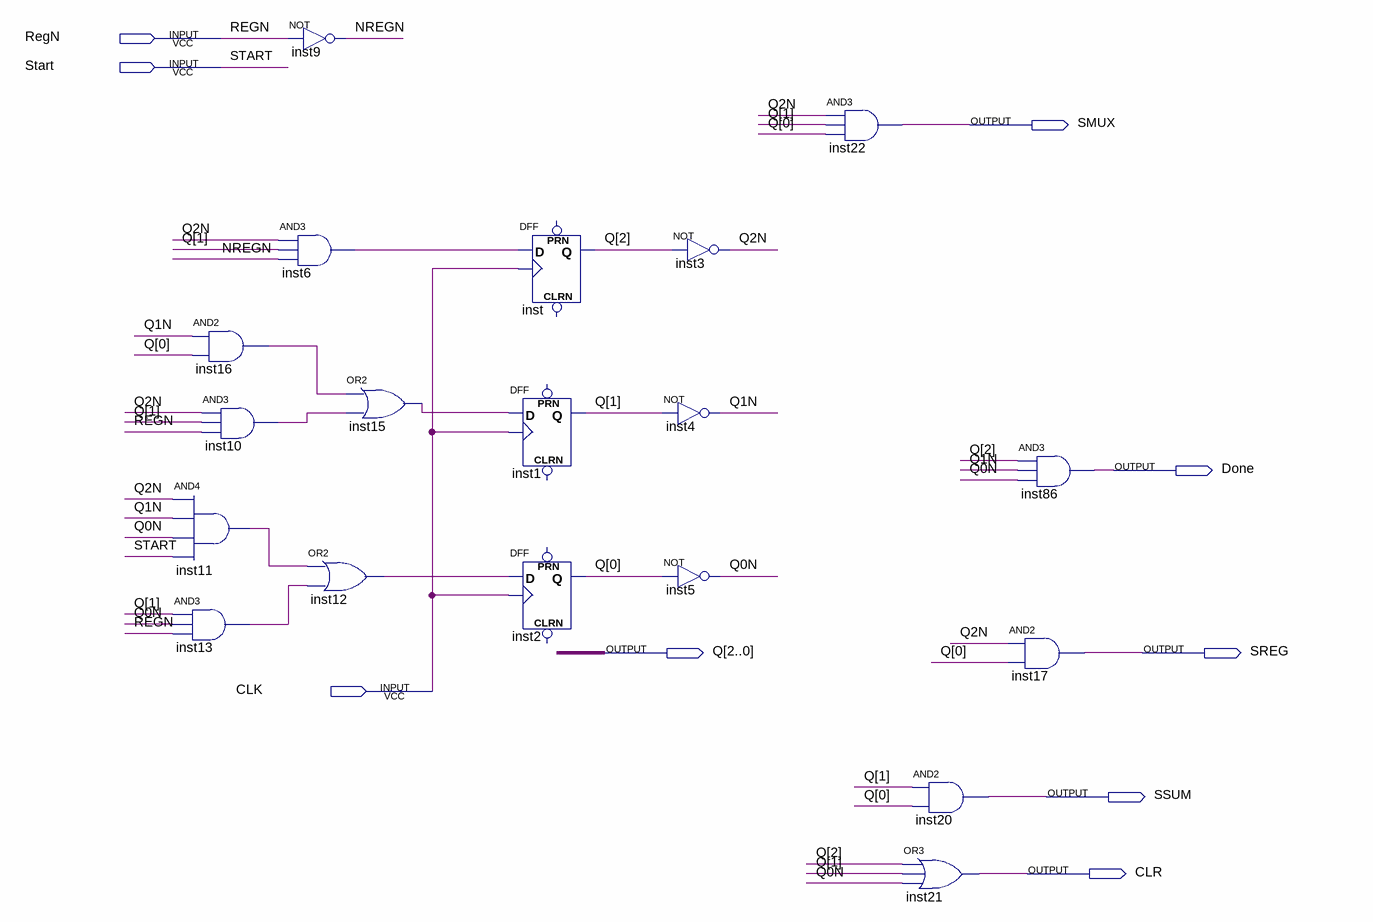
[diagram p0: schematic sheet]
// Quartus schematic CONTROLLLER2.bdf as structural Verilog: 19 symbols, 9 pins
module CONTROLLLER2 (
  input  RegN,
  input  Start,
  input  CLK,
  output SMUX,
  output Done,
  output [2:0] Q,
  output SREG,
  output SSUM,
  output CLR
);

  wire inst6_out, inst10_out, inst11_out, inst12_out, inst13_out, inst15_out, inst16_out, NREGN, Q0N, Q1N,
       Q2N;

  and inst16 (inst16_out, Q1N, Q[0]);
  and inst10 (inst10_out, Q2N, Q[1], RegN);
  and inst11 (inst11_out, Q2N, Q1N, Q0N, Start);
  and inst13 (inst13_out, Q[1], Q0N, RegN);
  and inst6 (inst6_out, Q2N, Q[1], NREGN);
  not inst9 (NREGN, RegN);
  or inst15 (inst15_out, inst16_out, inst10_out);
  or inst12 (inst12_out, inst11_out, inst13_out);
  DFF inst1 (.CLK(CLK), .D(inst15_out), .Q(Q[1]));  // open: CLRN, PRN
  DFF inst2 (.CLK(CLK), .D(inst12_out), .Q(Q[0]));  // open: CLRN, PRN
  DFF inst (.CLK(CLK), .D(inst6_out), .Q(Q[2]));  // open: CLRN, PRN
  not inst4 (Q1N, Q[1]);
  not inst5 (Q0N, Q[0]);
  not inst3 (Q2N, Q[2]);
  and inst22 (SMUX, Q2N, Q[1], Q[0]);
  and inst20 (SSUM, Q[1], Q[0]);
  or inst21 (CLR, Q[2], Q[1], Q0N);
  and inst86 (Done, Q[2], Q1N, Q0N);
  and inst17 (SREG, Q2N, Q[0]);
endmodule
